# EAGLE design mcuWallPower (EAGLE 6.4)
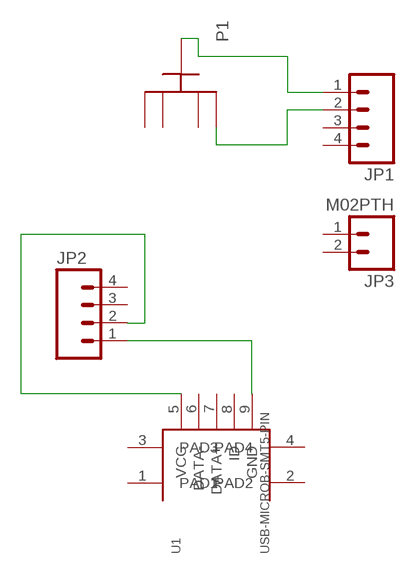
[diagram p0: schematic, sheet 1]

## Parts
JP1  M04PTH  [1X04]
JP2  M04PTH  [1X04]
JP3  M02PTH  [1X02]
P1  CR2032  [CR2032/2025]
U1  USB-MICROB-SMT5-PIN  [USB-MICROB-SMT]

## Nets
N$1: JP1.2 P1.VCC_1
N$2: JP1.1 P1.GND
N$3: JP2.1 U1.9(GND)
N$4: JP2.2 U1.5(VCC)
Unconnected: JP1.3 JP1.4 JP2.3 JP2.4 JP3.1 JP3.2 P1.VCC_2 P1.VCC_3 P1.VCC_4 U1.1(PAD1) U1.2(PAD2) U1.3(PAD3) U1.4(PAD4) U1.6(DATA-) U1.7(DATA+) U1.8(ID)

## Library data of the parts
JP1 JP2 = SparkFun-Connectors:M04: Header 4 Standard 4-pin 0.1" header. Use with straight break away headers (SKU : PRT-00116), right angle break away headers (PRT-00553), swiss pins (PRT-00743), machine pins (PRT-00117), and female headers (PRT-00115). Molex polarized connector foot print use with SKU : PRT-08231 with associated crimp pins and housings. 1MM SMD Version SKU: PRT-10208
JP3 = SparkFun-Connectors:M02: Standard 2-pin 0.1" header. Use with - straight break away headers ( PRT-00116) - right angle break away headers (PRT-00553) - swiss pins (PRT-00743) - machine pins (PRT-00117) - female headers (PRT-00115) Molex polarized connector foot print use with: PRT-08233 with associated crimp pins and housings. 2.54_SCREWTERM for use with PRT-10571. 3.5mm Screw Terminal footprints for PRT-08084 5mm Screw Terminal footprints for use with PRT-08433
P1 = freddyLibr:CR2032: CR2032/2025 20mm 3V lithium coin cell Great for battery packup. Both SMT and THM holders. Note the THM package has the ground pads on both sides of the PCB so that the masks are the same - this reduces the cost
U1 = freddyLibr:USB-MICROB-SMT: USB micro B receptacle. 5 pin surface mount variant.

## Board
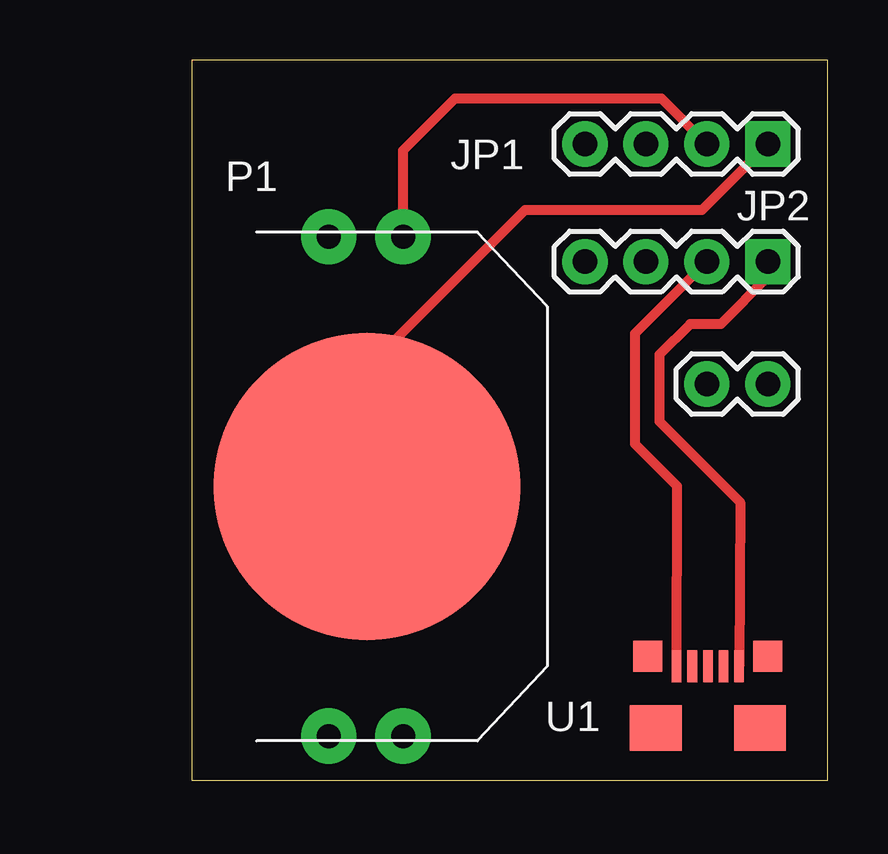
[diagram p1: board, top side]

Size 26.5 x 30 mm. Coordinates in mm from the lower left corner, seen from the top.
Outline: 0,0 26.5,0 26.5,30 0,30 0,0
Copper layers (1*16): Top 0.0356mm / dielectric 1.5011mm / Bottom 0.0356mm
Design rules "LaenPCBOrder": minimum track width 6mil, minimum drill 13mil, track to track 6mil, track to pad 6mil, pad to pad 6mil, via to via 6mil, smd to smd 6mil, copper to edge 15mil, drill to drill 6mil, minimum pad ring 7mil, minimum via ring 7mil, stop-mask expansion 3mil, vias tented up to drill 0mil, thermal gap 10mil

### Footprints (pad centres in the part's own frame; a part is rotated, then mirrored left to right if it is on the bottom)
1X04 = drill 1.016 pad 1.88 square: 1 0,0 | drill 1.016 pad 1.88: 2 2.54,0; 3 5.08,0; 4 7.62,0
1X02 = drill 1.016 pad 1.88: 1 0,0; 2 2.54,0
CR2032/2025 = smd 12.8 x 12.8: GND 0,0 | drill 1 pad 2.3: VCC_1 -10.4,1.5; VCC_2 -10.4,-1.6; VCC_3 10.4,1.5; VCC_4 10.4,-1.6
USB-MICROB-SMT = smd 2.15 x 1.9: 1 -2.17,-0.95; 2 2.17,-0.95 | smd 1.2 x 1.3: 3 -2.5,2.05; 4 2.5,2.05 | smd 0.4 x 1.35: 5 -1.3,1.63; 6 -0.65,1.63; 7 0,1.63; 8 0.65,1.63; 9 1.3,1.63

### Placement (x,y rotation side)
JP1  24,26.5 180 top
JP2  24,21.6 180 top
JP3  24,16.5 180 top
P1  7.3,12.23 270 top
U1  21.5,3.11 0 top

### Tracks (layer width: path | path; a pad name or v marks a point on that pad's centre or on a via)
N$1
  Top 0.406: P1.VCC_1 8.8,26.23 10.97,28.4 19.56,28.4 JP1.2
N$2
  Top 0.406: P1.GND 7.3,17.17 13.89,23.76 21.26,23.76 JP1.1
N$3
  Top 0.406: JP2.1 24,20.96 22.04,19 20.76,19 19.48,17.72 19.48,14.94 22.84,11.58 U1.9
N$4
  Top 0.406: U1.5 20.22,12.24 18.47,13.99 18.47,18.61 JP2.2

### Text on the board
bDocu: F. Lee / 03/10/2014 / mcuWallPower / R2